# EAGLE design nh-vend v0.2 (EAGLE 9.0.1)
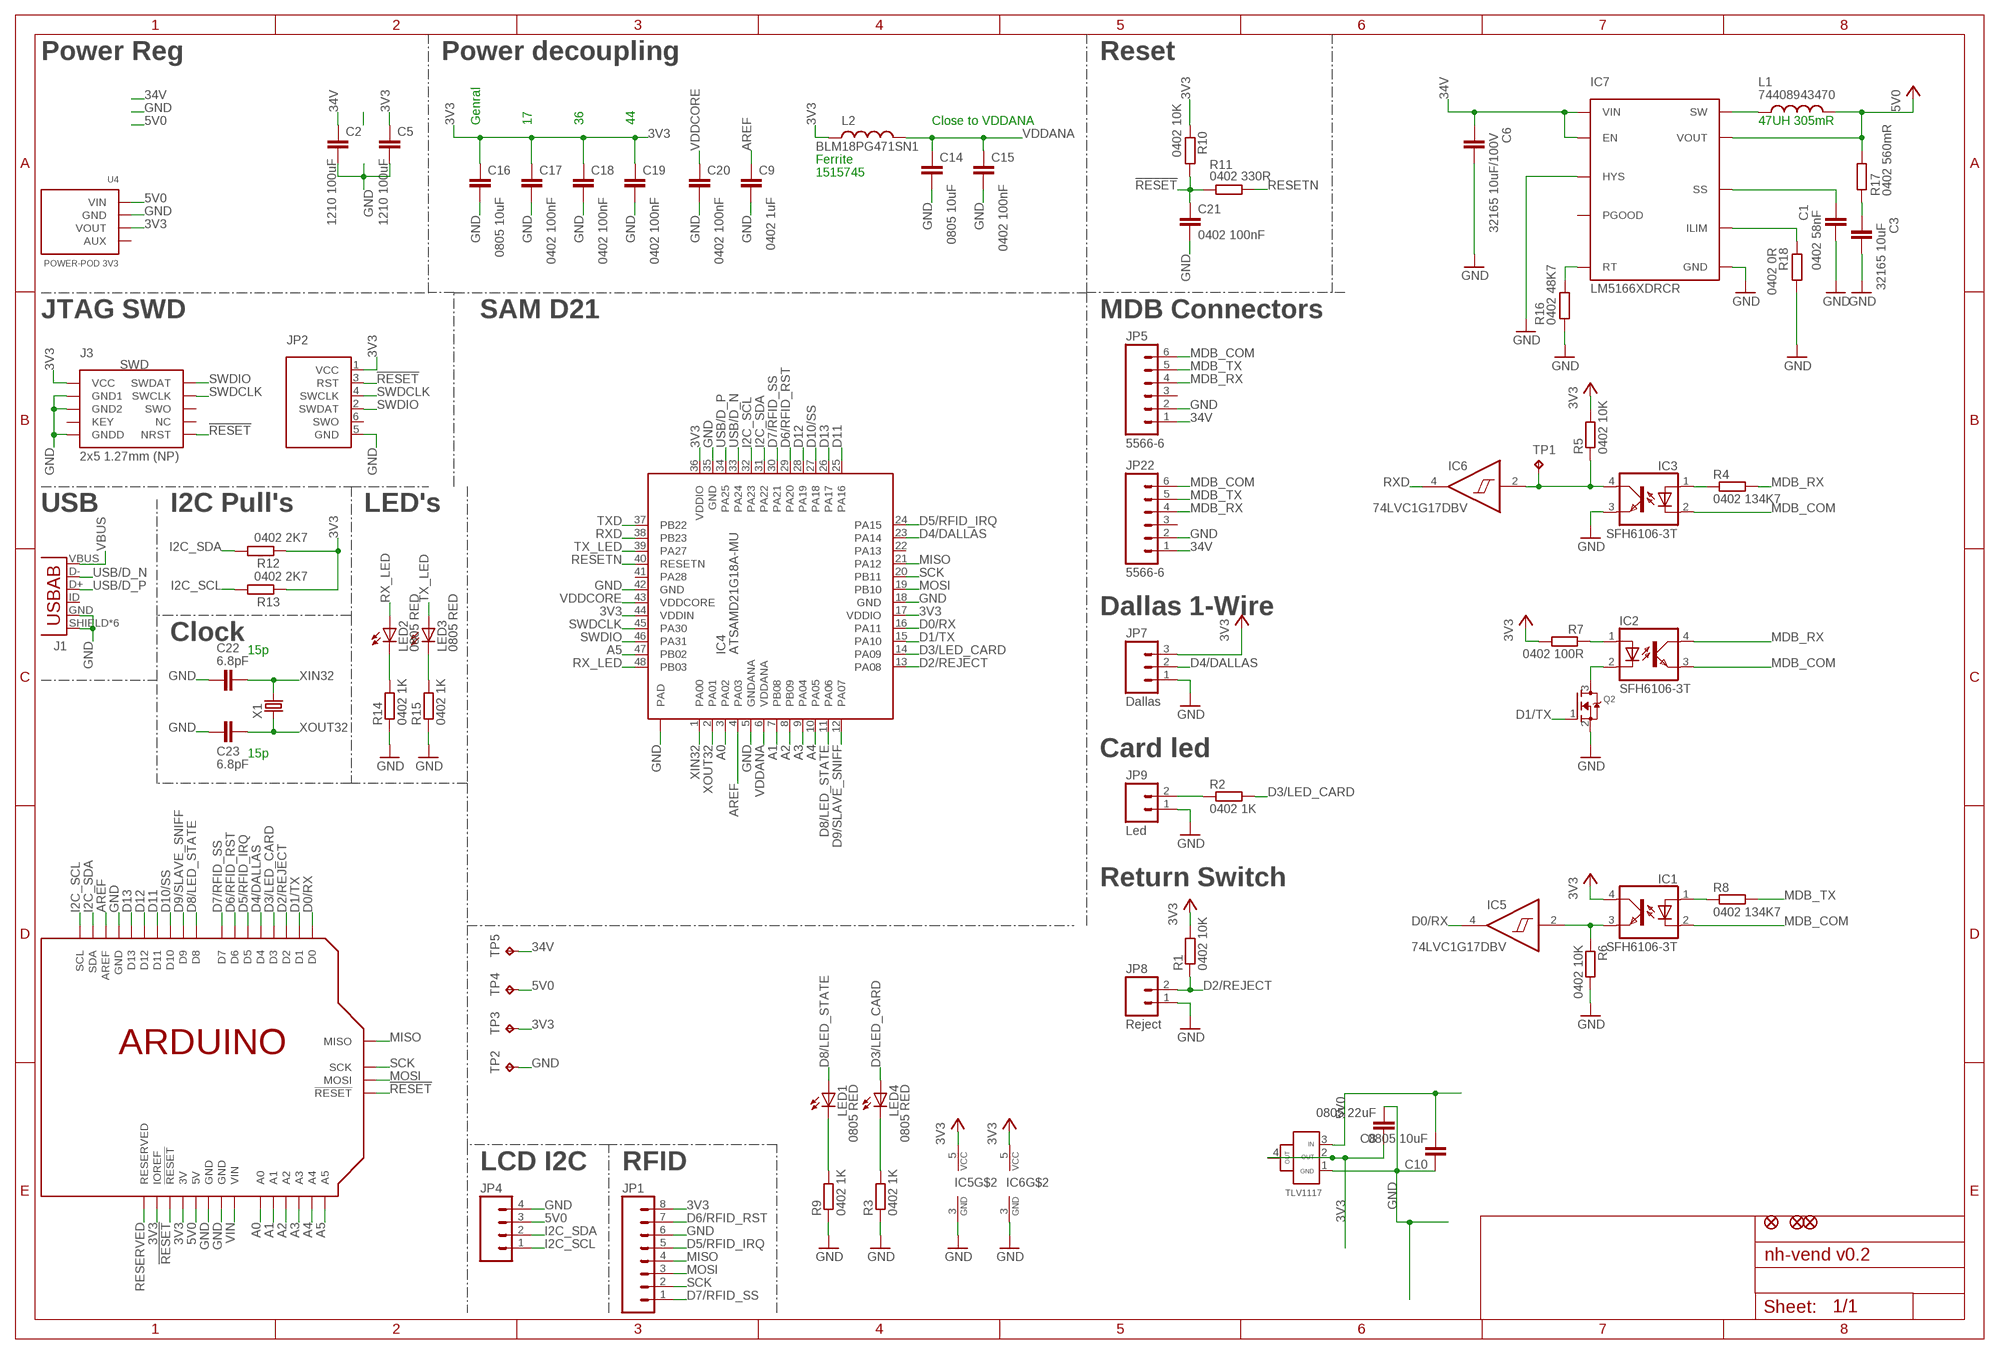
[diagram p0: schematic, sheet 1]

## Parts
C1  0402 58nF  C-EUC0402-SMALLER  [C0402-SMALLER]
C2  1210 100uF  C-EUC1210  [C1210]
C3  32165 10uF  C-EUC3216  [C3216]
C5  1210 100uF  C-EUC1210  [C1210]
C6  32165 10uF/100V  C-EUC3216  [C3216]
C8  0805 22uF  C-EUC0805  [C0805]
C9  0402 1uF  C-EUC0402-SMALLER  [C0402-SMALLER]
C10  0805 10uF  C-EUC0805  [C0805]
C14  0805 10uF  C-EUC0805K  [C0805K]
C15  0402 100nF  C-EUC0402-SMALLER  [C0402-SMALLER]
C16  0805 10uF  C-EUC0805K  [C0805K]
C17  0402 100nF  C-EUC0402-SMALLER  [C0402-SMALLER]
C18  0402 100nF  C-EUC0402-SMALLER  [C0402-SMALLER]
C19  0402 100nF  C-EUC0402-SMALLER  [C0402-SMALLER]
C20  0402 100nF  C-EUC0402-SMALLER  [C0402-SMALLER]
C21  0402 100nF  C-EUC0402-SMALLER  [C0402-SMALLER]
C22  6.8pF  C-EUC0402-SMALLER  [C0402-SMALLER]
C23  6.8pF  C-EUC0402-SMALLER  [C0402-SMALLER]
IC1  SFH6106-3T  OPTO-DC  [SO04]
IC2  SFH6106-3T  OPTO-DC  [SO04]
IC3  SFH6106-3T  OPTO-DC  [SO04]
IC4  ATSAMD21G18A-MU  ATSAMD21G-LWK  [QFN48-LWK]
IC5  74LVC1G17DBV  [SOT23-5]
IC6  74LVC1G17DBV  [SOT23-5]
IC7  LM5166XDRCR  LM5166  [VSON-10]
J1  ZX62-AB-5PA(11)  USB-AB-LWK  [USB-AB-MICRO-SMD_LWK]
J3  2x5 1.27mm (NP)  SWD_SHROUD-PINHEAD  [PINHEAD_2X05_127]
JP1  M081X08  [1X08]
JP2  (NP)  TC2030-SWDNL  [TC2030-MCP-NL]
JP3  FIDUCIAL1X2.5-STOP  [FIDUCIAL-1X2.5-STOP]
JP4  M04PTH  [1X04]
JP5  5566-6  M06-5566  [5566-6]
JP6  FIDUCIAL1X2.5-STOP  [FIDUCIAL-1X2.5-STOP]
JP7  Dallas  M03-SCREW-5MM  [SCREWTERMINAL-5MM-3]
JP8  Reject  M025MM  [SCREWTERMINAL-5MM-2]
JP9  Led  M025MM  [SCREWTERMINAL-5MM-2]
JP10  FIDUCIAL1X2.5-STOP  [FIDUCIAL-1X2.5-STOP]
JP22  5566-6  M06-5566  [5566-6]
L1  74408943470  INDUCTOR-WE-SPC  [WE-SPC_48XX]
L2  BLM18PG471SN1  INDUCTOR0603K-SMALL  [C0603K-SMALL]
LED1  0805 RED  LED0805-1206  [LED-0805-1206]
LED2  0805 RED  LED0805-1206  [LED-0805-1206]
LED3  0805 RED  LED0805-1206  [LED-0805-1206]
LED4  0805 RED  LED0805-1206  [LED-0805-1206]
Q2  MOSFET-N-SOT23-SPARK  [SOT23-3]
R1  0402 10K  R-EU_R0402-SMALLER  [R0402-SMALLER]
R2  0402 1K  R-EU_R0402-SMALLER  [R0402-SMALLER]
R3  0402 1K  R-EU_R0402-SMALLER  [R0402-SMALLER]
R4  0402 134K7  R-EU_R0402-SMALLER  [R0402-SMALLER]
R5  0402 10K  R-EU_R0402-SMALLER  [R0402-SMALLER]
R6  0402 10K  R-EU_R0402-SMALLER  [R0402-SMALLER]
R7  0402 100R  R-EU_R0402-SMALLER  [R0402-SMALLER]
R8  0402 134K7  R-EU_R0402-SMALLER  [R0402-SMALLER]
R9  0402 1K  R-EU_R0402-SMALLER  [R0402-SMALLER]
R10  0402 10K  R-EU_R0402-SMALLER  [R0402-SMALLER]
R11  0402 330R  R-EU_R0402-SMALLER  [R0402-SMALLER]
R12  0402 2K7  R-EU_R0402-SMALLER  [R0402-SMALLER]
R13  0402 2K7  R-EU_R0402-SMALLER  [R0402-SMALLER]
R14  0402 1K  R-EU_R0402-SMALLER  [R0402-SMALLER]
R15  0402 1K  R-EU_R0402-SMALLER  [R0402-SMALLER]
R16  0402 48K7  R-EU_R0402-SMALLER  [R0402-SMALLER]
R17  0402 560mR  R-EU_R0402-SMALLER  [R0402-SMALLER]
R18  0402 0R  R-EU_R0402-SMALLER  [R0402-SMALLER]
TP1  TPPAD1-10-ROUND  [P1-10-ROUND-CAN]
TP2  TPPAD1-10-ROUND  [P1-10-ROUND-CAN]
TP3  TPPAD1-10-ROUND  [P1-10-ROUND-CAN]
TP4  TPPAD1-10-ROUND  [P1-10-ROUND-CAN]
TP5  TPPAD1-10-ROUND  [P1-10-ROUND-CAN]
U1  ARDUINOSPI-REFRENCE  [ARDUINOR3-LWKTXT-REF-SPI]
U03  1117 3V0  TLV1117-33CDCY  [SOT223]
U4  POWER-POD 3V3  POWER-POD  [POWER-POD-LANDING]
X1  RESONATOR_EPSON_FC_145  [RESONATOR_EPSON_FC_145]

## Nets
3V3: C5.1 C8.1 C16.1 C17.1 C18.1 C19.1 IC1.4(COL) IC4.17(VDDIO) IC4.36(VDDIO) IC4.44(VDDIN) IC5.5(VCC) IC6.5(VCC) J3.1(VCC) JP1.8 JP2.1(VCC) JP7.3 L2.1 R1.2 R5.2 R7.2 R10.1 R12.1 R13.1 TP3.TP U1.3V U1.IOREF U03.2(OUT1) U03.4(OUT2) U4.3(VOUT)
5V0: C10.2 IC7.8(VOUT) JP4.3 L1.2 R17.1 TP4.TP U1.5V U1.5V@ISP(5V) U03.3(IN) U4.1(VIN)
34V [34V]: C2.1 C6.1 IC7.2(VIN) IC7.7(EN) JP5.1 JP22.1 TP5.TP
!RESET: C21.1 J3.10(NRST) JP2.3(RST) R10.2 R11.1 U1.!RESET U1.!RESET@ISP(!RESET)
A0: IC4.3(PA02) U1.A0
A1: IC4.7(PB08) U1.A1
A2: IC4.8(PB09) U1.A2
A3: IC4.9(PA04) U1.A3
A4: IC4.10(PA05) U1.A4
A5: IC4.47(PB02) U1.A5
AREF: C9.1 IC4.4(PA03) U1.AREF
D0/RX: IC4.16(PA11) IC5.4(O) U1.D0
D1/TX: IC4.15(PA10) Q2.1(G) U1.D1
D2/REJECT: IC4.13(PA08) JP8.2 R1.1 U1.D2
D3/LED_CARD: IC4.14(PA09) LED4.A R2.2 U1.D3
D4/DALLAS: IC4.23(PA14) JP7.2 U1.D4
D5/RFID_IRQ: IC4.24(PA15) JP1.5 U1.D5
D6/RFID_RST: IC4.29(PA20) JP1.7 U1.D6
D7/RFID_SS: IC4.30(PA21) JP1.1 U1.D7
D8/LED_STATE: IC4.11(PA06) LED1.A U1.D8
D9/SLAVE_SNIFF: IC4.12(PA07) U1.D9
D10/SS: IC4.27(PA18) U1.D10
D11: IC4.25(PA16) U1.D11
D12: IC4.28(PA19) U1.D12
D13: IC4.26(PA17) U1.D13
GND: C1.2 C2.2 C3.2 C5.2 C6.2 C8.2 C9.2 C10.1 C14.2 C15.2 C16.2 C17.2 C18.2 C19.2 C20.2 C21.2 C22.2 C23.2 IC3.3(EMIT) IC4.5(GNDANA) IC4.18(GND) IC4.35(GND) IC4.42(GND) IC4.EXP(PAD) IC5.3(GND) IC6.3(GND) IC7.9(HYS) IC7.10(GND) IC7.PAD(GND) J1.GND J1.SHIELD J1.SHIELD@0(SHIELD) J1.SHIELD@1(SHIELD) J1.SHIELD@2(SHIELD) J1.SHIELD@3(SHIELD) J1.SHIELD@5(SHIELD) J3.3(GND1) J3.5(GND2) J3.9(GNDD) JP1.6 JP2.5(GND) JP4.4 JP5.2 JP7.1 JP8.1 JP9.1 JP22.2 Q2.2(S) R3.1 R6.2 R9.1 R14.1 R15.1 R16.1 R18.1 TP2.TP U1.GND@1(GND) U1.GND@2(GND) U1.GND@3(GND) U1.GND@ISP(GND) U03.1(GND) U4.2(GND)
I2C_SCL: IC4.32(PA23) JP4.1 R13.2 U1.SCL
I2C_SDA: IC4.31(PA22) JP4.2 R12.2 U1.SDA
ILIM: IC7.3(ILIM) R18.2
LED_R: JP9.2 R2.1
MDB_COM [34V]: IC1.2(C) IC2.3(EMIT) IC3.2(C) JP5.6 JP22.6
MDB_RX [34V]: IC2.4(COL) JP5.4 JP22.4 R4.2
MDB_TX [34V]: JP5.5 JP22.5 R8.2
MISO: IC4.21(PA12) JP1.4 U1.MISO
MOSI: IC4.19(PB10) JP1.3 U1.MOSI
N$1 [34V]: IC3.1(A) R4.1
N$2: IC1.1(A) R8.1
N$3: LED4.C R3.2
N$6: IC2.1(A) R7.1
N$7: IC2.2(C) Q2.3(D)
N$8: LED1.C R9.2
N$9: LED2.C R14.2
N$10: LED3.C R15.2
N$11: IC7.5(RT) R16.2
N$12: C3.1 R17.2
RESERVED: U1.RESERVED
RESETN: IC4.40(RESETN) R11.2
RX: IC1.3(EMIT) IC5.2(I) R6.1
RX_LED: IC4.48(PB03) LED2.A
RXD: IC4.38(PB23) IC6.4(O)
SCK: IC4.20(PB11) JP1.2 U1.SCK
SLAVE_SNIFF: IC3.4(COL) IC6.2(I) R5.1 TP1.TP
SS: C1.1 IC7.4(SS)
SW: IC7.1(SW) L1.1
SWDCLK: IC4.45(PA30) J3.4(SWCLK) JP2.4(SWCLK)
SWDIO: IC4.46(PA31) J3.2(SWDAT) JP2.2(SWDAT)
TX_LED: IC4.39(PA27) LED3.A
TXD: IC4.37(PB22)
USB/D_N [90R]: IC4.33(PA24) J1.D-
USB/D_P [90R]: IC4.34(PA25) J1.D+
VBUS: J1.VBUS
VDDANA: C14.1 C15.1 IC4.6(VDDANA) L2.2
VDDCORE: C20.1 IC4.43(VDDCORE)
VIN [34V]: U1.VIN
XIN32: C22.1 IC4.1(PA00) X1.P$2
XOUT32: C23.1 IC4.2(PA01) X1.P$1
Unconnected: IC4.22(PA13) IC4.41(PA28) IC7.6(PGOOD) J1.ID(USBID) J3.6(SWO) J3.7(KEY) J3.8(NC) JP2.6(SWO) JP5.3 JP22.3 U4.4(AUX)

## Notes on the sheet
- Power Reg | Power decoupling | Reset
- Genral | 17 | 36 | 44 | Close to VDDANA | 47UH 305mR
- Ferrite
- 1515745
- JTAG SWD | SAM D21 | MDB Connectors
- USB | I2C Pull's | LED's
- Dallas 1-Wire
- Clock
- 15p
- 15p | Card led
- Return Switch
- LCD I2C | RFID

## Library data of the parts
C1-C3 C5 C6 C9 C14-C23 = CISECO eaglecad designs:C-EU: CAPACITOR, European symbol
C8 C10 = rcl:C-EU: CAPACITOR, European symbol
IC1-IC3 = SmartSentry Parts:OPTO-DC
IC4 = CISECO eaglecad designs:ATSAMD21G
IC5 IC6 = 74xx-little-us:74*1G17: Single Schmitt-Trigger Buffer
IC7 = SmartSentry Parts:LM5166
J1 = TiLDA Mk3 Parts:USB-AB: This is a USB AB connector that is compatible with USB OTG. i.e. this connector can serve as a host or device; FARNELL: 2293755
J3 = TiLDA Mk3 Parts:SWD_SHROUD; FARNELL: 1865285
JP1 = SparkFunJan12:M08: Header 8 Standard 8-pin 0.1" header. Use with straight break away headers (SKU : PRT-00116), right angle break away headers (PRT-00553), swiss pins (PRT-00743), machine pins (PRT-00117), and female headers (PRT-00115).
JP2 = TiLDA Mk3 Parts:TC2030-SWD
JP3 JP6 JP10 = CISECO eaglecad designs:FIDUCIAL: Fiducial Alignment Points Various fiducial points for machine vision alignment.
JP4 = SparkFunJan12:M04: Header 4 Standard 4-pin 0.1" header. Use with straight break away headers (SKU : PRT-00116), right angle break away headers (PRT-00553), swiss pins (PRT-00743), machine pins (PRT-00117), and female headers (PRT-00115). Molex polarized connector foot print use with SKU : PRT-08231 with associated crimp pins and housings. 1MM SMD Version SKU: PRT-10208
JP5 JP22 = CISECO eaglecad designs:M06: Header 6 Standard 6-pin 0.1" header. Use with straight break away headers (SKU : PRT-00116), right angle break away headers (PRT-00553), swiss pins (PRT-00743), machine pins (PRT-00117), and female headers (PRT-00115). Molex polarized connector foot print use with SKU : PRT-08094 with associated crimp pins and housings. NOTES ON THE VARIANTS LOCK and LOCK_LONGPADS... This footprint was designed to help hold the alignment of a through-hole component (i.e. 6-pin header) while soldering it into place. You may notice that each hole has been shifted either up or down by 0.005 of an inch from it's more standard position (which is a perfectly straight line). This slight alteration caused the pins (the squares in the middle) to touch the edges of the holes. Because they are alternating, it causes a "brace" to hold the component in place. 0.005 has proven to be the perfect amount of "off-center" position when using our standard breakaway headers. Although looks a little odd when you look at the bare footprint, once you have a header in there, the alteration is very hard to notice. Also, if you push a header all the way into place, it is covered up entirely on the bottom side. This idea of altering the position of holes to aid alignment will be further integrated into the Sparkfun Library for other footprints. It can help hold any component with 3 or more connection pins.; FARNELL: 9732101 or 1697112; MF: Molex
JP7 = CISECO eaglecad designs:M03: Header 3 Standard 3-pin 0.1" header. Use with straight break away headers (SKU : PRT-00116), right angle break away headers (PRT-00553), swiss pins (PRT-00743), machine pins (PRT-00117), and female headers (PRT-00115). Molex polarized connector foot print use with SKU : PRT-08232 with associated crimp pins and housings.
JP8 JP9 = SmartSentry Parts:M02: Header 2 Standard 2-pin 0.1" header. Use with straight break away headers (SKU : PRT-00116), right angle break away headers (PRT-00553), swiss pins (PRT-00743), machine pins (PRT-00117), and female headers (PRT-00115). Molex polarized connector foot print use with SKU : PRT-08233 with associated crimp pins and housings.
L1 = SmartSentry Parts:INDUCTOR: Inductors Basic Inductor/Choke - 0603 and 1206. Footprints are not proven and vary greatly between part numbers.
L2 = CISECO eaglecad designs:INDUCTOR: Inductors Basic Inductor/Choke - 0603 and 1206. Footprints are not proven and vary greatly between part numbers.
LED1-LED4 = CISECO eaglecad designs:LED: LEDs Standard schematic elements and footprints for 5mm, 3mm, 1206, and 0603 sized LEDs. 5mm - Spark Fun Electronics SKU : COM-00529 (and others)
Q2 = SmartSentry Parts:MOSFET-N: N-Channel Mosfet 2N7002E - 60V 260mA SOT23 [Digikey: 2N7002ET1GOSTR-ND] - REEL BSH103 - 30V 850mA SOT23 [Digikey: 568-5013-1-ND]
R1-R18 = CISECO eaglecad designs:R-EU_: RESISTOR, European symbol
TP1-TP5 = SmartSentry Parts:TP: Test pad
U1 = CISECO eaglecad designs:ARDUINOSPI
U03 = CISECO eaglecad designs:TLV1117-33CDCY
U4 = Ciseco Footprints:POWER-POD
X1 = TiLDA Mk2 Parts:RESONATOR_EPSON_FC_145

## Net classes
1 34V: clearance 0.5 mm
2 MAINS: clearance 0.5 mm to class 1, clearance 4 mm
3 90R: width 0.254 mm, clearance 0.3 mm to class 0, clearance 0.5 mm to class 1, clearance 4 mm to class 2, clearance 0.15 mm

## Board
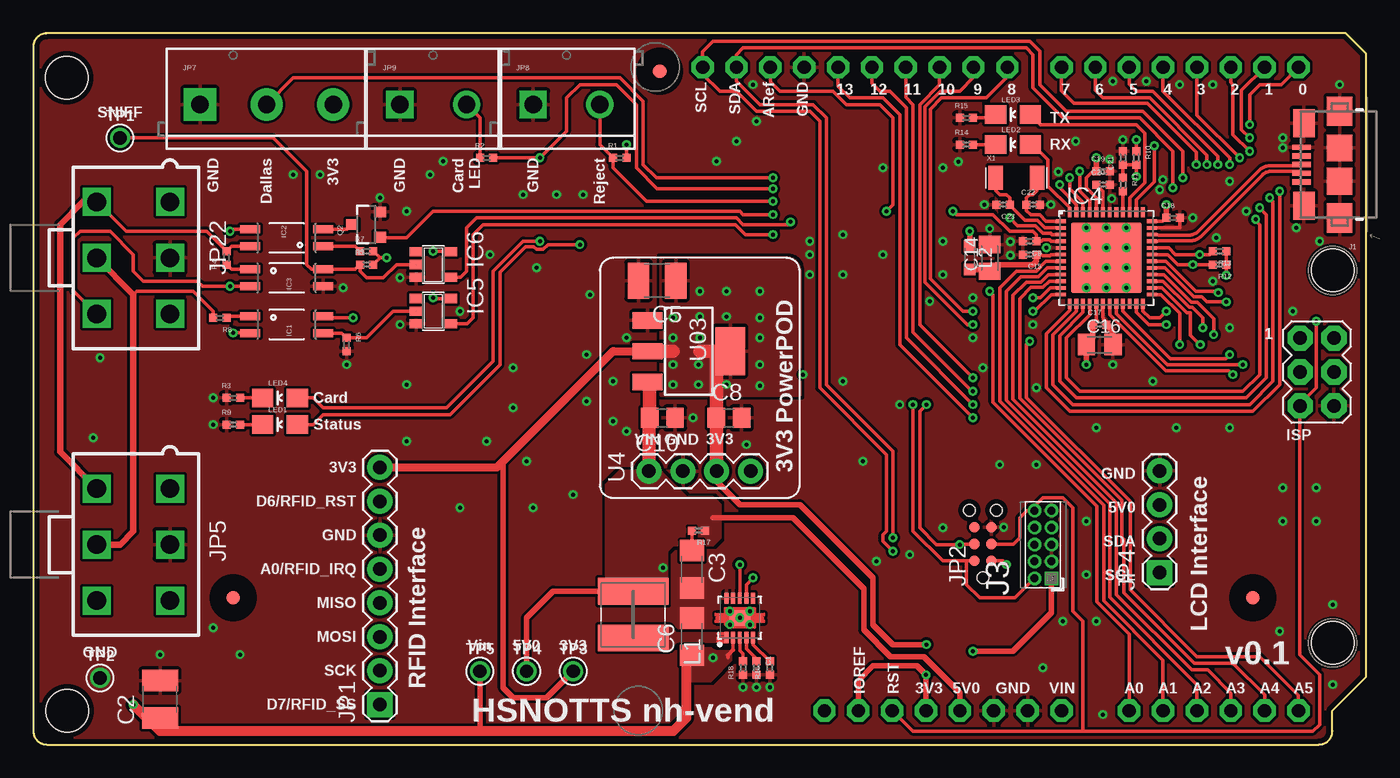
[diagram p1: board, top side]
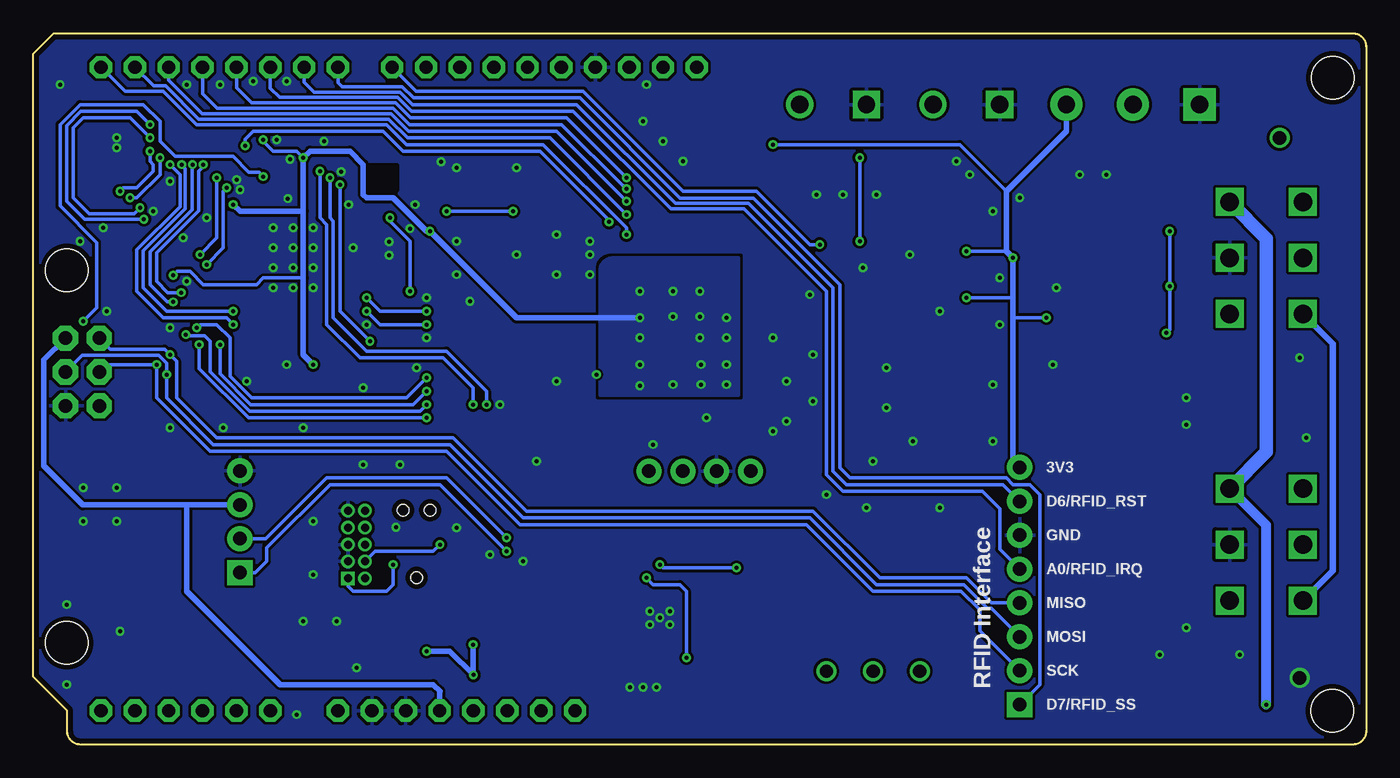
[diagram p2: board, bottom side, seen from below]

Size 100 x 53.34 mm. Coordinates in mm from the lower left corner, seen from the top.
Outline: 98.48,53.34 1,53.34 arc90 0,52.34 0,1 arc90 1,0 96.46,0 arc90 97.46,1 97.46,2.54 100,5.08 100,51.82 98.48,53.34
Copper layers (1*16): Top 0.0356mm / dielectric 1.5011mm / Bottom 0.0356mm
Design rules "default *": minimum track width 0.15mm, minimum drill 0.3mm, track to track 6mil, track to pad 6mil, pad to pad 6mil, via to via 6mil, smd to smd 6mil, copper to edge 15mil, drill to drill 12mil, minimum pad ring 7mil, minimum via ring 7mil, stop-mask expansion 3mil, vias tented up to drill 23mil, thermal gap 10mil
Holes 3.2 mm at 2.54,2.54 97.48,35.56 97.48,7.62 2.5,50

### Footprints (pad centres in the part's own frame; a part is rotated, then mirrored left to right if it is on the bottom)
C0402-SMALLER = smd 0.6 x 0.6: 1 -0.5,0; 2 0.5,0
C1210 = smd 1.6 x 2.7: 1 -1.4,0; 2 1.4,0
C3216 = smd 1.6 x 1.8: 1 -1.4,0; 2 1.4,0
C0805 = smd 1.3 x 1.5: 1 -0.95,0; 2 0.95,0
C0805K = smd 1.3 x 1.6: 1 -1,0; 2 1,0
SO04 = smd 0.6 x 1.5: 1 -0.635,-2.75; 2 0.635,-2.75; 3 0.635,2.75; 4 -0.635,2.75
QFN48-LWK = smd 0.75 x 0.28: 1 -3.425,2.75; 2 -3.425,2.25; 3 -3.425,1.75; 4 -3.425,1.25; 5 -3.425,0.75; 6 -3.425,0.25; 7 -3.425,-0.25; 8 -3.425,-0.75; 9 -3.425,-1.25; 10 -3.425,-1.75; 11 -3.425,-2.25; 12 -3.425,-2.75; 25 3.425,-2.75; 26 3.425,-2.25; 27 3.425,-1.75; 28 3.425,-1.25; 29 3.425,-0.75; 30 3.425,-0.25; 31 3.425,0.25; 32 3.425,0.75; 33 3.425,1.25; 34 3.425,1.75; 35 3.425,2.25; 36 3.425,2.75 | smd 0.28 x 0.75: 13 -2.75,-3.425; 14 -2.25,-3.425; 15 -1.75,-3.425; 16 -1.25,-3.425; 17 -0.75,-3.425; 18 -0.25,-3.425; 19 0.25,-3.425; 20 0.75,-3.425; 21 1.25,-3.425; 22 1.75,-3.425; 23 2.25,-3.425; 24 2.75,-3.425; 37 2.75,3.425; 38 2.25,3.425; 39 1.75,3.425; 40 1.25,3.425; 41 0.75,3.425; 42 0.25,3.425; 43 -0.25,3.425; 44 -0.75,3.425; 45 -1.25,3.425; 46 -1.75,3.425; 47 -2.25,3.425; 48 -2.75,3.425 | smd 5.3 x 5.3: EXP 0,0
SOT23-5 = smd 0.69 x 0.99: 1 -0.95,-1.29; 2 0,-1.29; 3 0.95,-1.29; 4 0.95,1.3; 5 -0.95,1.3
VSON-10 = smd 0.85 x 0.28: 1 -1.475,1; 2 -1.475,0.5; 3 -1.475,0; 4 -1.475,-0.5; 5 -1.475,-1; 6 1.475,-1; 7 1.475,-0.5; 8 1.475,0; 9 1.475,0.5; 10 1.475,1 | smd 1.15 x 1.5: PAD 0,0
USB-AB-MICRO-SMD_LWK = smd 1.4 x 0.4: D+ 2.85,0; D- 2.85,0.65; GND 2.85,-1.3; ID 2.85,-0.65; VBUS 2.85,1.3 | smd 1.6 x 2.1: SHIELD 2.675,3.1; SHIELD@5 2.675,-3.1 | smd 1.9 x 2: SHIELD@0 0,1.25; SHIELD@1 0,-1.25 | smd 1.9 x 2.2: SHIELD@2 0,-4; SHIELD@3 0,4
PINHEAD_2X05_127 = drill 0.6 pad 1.016 square: 1 -2.54,-0.635 | drill 0.6 pad 1.016: 2 -2.54,0.635; 3 -1.27,-0.635; 4 -1.27,0.635; 5 0,-0.635; 6 0,0.635; 7 1.27,-0.635; 8 1.27,0.635; 9 2.54,-0.635; 10 2.54,0.635
1X08 = drill 1.016 pad 1.88 square: 1 0,0 | drill 1.016 pad 1.88: 2 2.54,0; 3 5.08,0; 4 7.62,0; 5 10.16,0; 6 12.7,0; 7 15.24,0; 8 17.78,0
TC2030-MCP-NL = smd 0.787 x 0.787: 1 1.27,-0.635; 2 1.27,0.635; 3 2.54,-0.635; 4 2.54,0.635; 5 3.81,-0.635; 6 3.81,0.635 | hole 0.889: 0,0; 5.08,-1.016; 5.08,1.016
FIDUCIAL-1X2.5-STOP = smd 1 x 1: 1 0,0
1X04 = drill 1.016 pad 1.88 square: 1 0,0 | drill 1.016 pad 1.88: 2 2.54,0; 3 5.08,0; 4 7.62,0
5566-6 = drill 1.4 square: 1 4.2,-2.75; 2 0,-2.75; 3 -4.2,-2.75; 4 4.2,2.75; 5 0,2.75; 6 -4.2,2.75
SCREWTERMINAL-5MM-3 = drill 1.3 pad 2.413 square: 1 0,0 | drill 1.3 pad 2.413: 2 5,0; 3 10,0
SCREWTERMINAL-5MM-2 = drill 1.3 pad 2.032 square: 1 0,0 | drill 1.3 pad 2.032: 2 5,0
WE-SPC_48XX = smd 2 x 5.3: 1 -1.75,0; 2 1.75,0
C0603K-SMALL = smd 0.889 x 0.889: 1 -0.875,0; 2 0.875,0
LED-0805-1206 = smd 1.6 x 1.4: A 1.3,0; C -1.3,0
SOT23-3 = smd 0.9 x 0.8: 1 1,-0.95; 2 1,0.95; 3 -1.1,0
R0402-SMALLER = smd 0.6 x 0.6: 1 -0.5,0; 2 0.5,0
P1-10-ROUND-CAN = drill 1: TP 0,0
ARDUINOR3-LWKTXT-REF-SPI = drill 1 pad 1.676 octagon: 3V 35.56,2.54; 5V 38.1,2.54; !RESET 33.02,2.54; A0 50.8,2.54; A1 53.34,2.54; A2 55.88,2.54; A3 58.42,2.54; A4 60.96,2.54; A5 63.5,2.54; AREF 23.876,50.8; D0 63.5,50.8; D1 60.96,50.8; D2 58.42,50.8; D3 55.88,50.8; D4 53.34,50.8; D5 50.8,50.8; D6 48.26,50.8; D7 45.72,50.8; D8 41.656,50.8; D9 39.116,50.8; D10 36.576,50.8; D11 34.036,50.8; D12 31.496,50.8; D13 28.956,50.8; GND@1 43.18,2.54; GND@2 40.64,2.54; GND@3 26.416,50.8; IOREF 30.48,2.54; RESERVED 27.94,2.54; SCL 18.796,50.8; SDA 21.336,50.8; VIN 45.72,2.54 | drill 1.016 pad 1.88 octagon: 5V@ISP 66.167,30.48; !RESET@ISP 63.627,25.4; GND@ISP 66.167,25.4; MISO 63.627,30.48; MOSI 66.167,27.94; SCK 63.627,27.94
SOT223 = smd 1.219 x 2.235: 1 -2.311,-3.099; 2 0,-3.099; 3 2.311,-3.099 | smd 3.6 x 2.2: 4 0,3.099
POWER-POD-LANDING = drill 1.016 pad 1.88: 1 -3.81,0; 2 -1.27,0; 3 1.27,0; 4 3.81,0
RESONATOR_EPSON_FC_145 = smd 1.1 x 1.8: P$1 -1.55,0; P$2 1.55,0

### Placement (x,y rotation side)
C1  54.25,5.75 270 top
C2  9.5,3.4 90 top
C3  49.4,13.15 270 top
C5  46.8,34.8 180 top
C6  49.4,8.1 90 top
C8  52.19,24.5 0 top
C9  74.75,37.75 180 top
C10  47.19,24.5 180 top
C14  71.75,36.5 90 top
C15  74.75,36.75 180 top
C16  80,30 0 top
C17  80,31.5 0 top
C18  85.5,39.5 0 top
C19  80.25,43 0 top
C20  80.25,42 0 top
C21  81.75,44 90 top
C22  75,40.5 0 top
C23  72.75,40.5 180 top
IC1  19,31.5 270 top
IC2  19,38 90 top
IC3  19,35 270 top
IC4  80.5,36.5 0 top
IC5  30,32.5 270 top
IC6  30,36 270 top
IC7  53,9.5 90 top
J1  98,43.5 180 top
J3  75.75,15 90 top
JP1  26,3 90 top
JP2  71.25,12.5 90 top
JP3  91.5,11 0 top
JP4  84.5,12.9 90 top
JP5  7.5,15 90 top
JP6  47,50.5 0 top
JP7  12.5,48 0 top
JP8  37.5,48 0 top
JP9  27.5,48 0 top
JP10  15,11 0 top
JP22  7.5,36.5 90 top
L1  45,9.75 90 top
L2  70.25,36.5 270 top
LED1  18.5,24 0 top
LED2  73.5,45 0 top
LED3  73.5,47.25 0 top
LED4  18.5,26 0 top
Q2  25,39 0 top
R1  44,44 0 top
R2  34,44 0 top
R3  15,26 0 top
R4  14.5,36.5 90 top
R5  25,36 0 top
R6  23.5,30 270 top
R7  25,37 0 top
R8  14,32 180 top
R9  15,24 0 top
R10  82.75,44 270 top
R11  81.75,42 270 top
R12  89,36 180 top
R13  89,37 180 top
R14  70,45 0 top
R15  70,47 0 top
R16  55.25,5.75 90 top
R17  49.9,16.05 180 top
R18  53.25,5.75 90 top
TP1  6.5,45.5 0 top
TP2  5,5 0 top
TP3  40.5,5.5 0 top
TP4  37,5.5 0 top
TP5  33.5,5.5 0 top
U1  31.42,0 0 top
U03  49.19,29.5 270 top
U4  50,20.5 0 top
X1  73.75,42.5 0 top

### Tracks (layer width: path | path; a pad name or v marks a point on that pad's centre or on a via)
3V3  (via drill 0.3)
  Top 0.254: R7.2 26,36.5 | 26,36.5 v26.5,36.5 | R5.2 26,36.5 | IC1.4 21.89,32 v24,32 | R1.2 v44.5,45 | IC4.44 79.75,41 79,41.75 79,42.5 79.5,43 C19.1 | R10.1 v82.75,45.35 | IC4.17 79.75,31.75 | IC4.36 84.75,39.25 C18.1 | IC6.5 31.25,37 v30,37 | 89.5,36.75 R13.1 R12.1 | 89.5,35.75 R12.1 | JP2.1 72.73,13.77 v73,13.5 | R12.1 v89.5,35.2 | IC5.5 30.05,33.45 v30,33.5
  Top 0.4: C19.1 v79.75,44 | L2.1 v70.25,38.5 | 79.75,31.75 C17.1 79.5,30.5 C16.1 v79,28.5 | C18.1 v85,40.5 | J3.1 76.39,9.88 73.5,7 v70.5,7 | U1.IOREF 61.9,4.8 63,5.9
  Top 0.406: U1.3V v66.98,5.22 66.3,5.9 63,5.9 | U4.3 51.27,19.73 53,18 57.5,18 63,12.5 63,9 64.5,7.5 v67,7.5 | TP3.TP 38.5,3.5 36,3.5 35.25,4.25 35.25,21.25 36.25,22.25
  Top 0.61: JP1.8 34.78,20.78 36.25,22.25 43.5,29.5 U03.2
  Top 1.016: U03.2 48,29.5 | 50,29.5 U03.4 51.24,29.5 C8.1 51.27,24.5 U4.3
  Bottom 0.254: v24,32 26.5,32 | v44.5,45 30.5,45 27,41.5 | v30,37 27,37 | v73,13.5 73,12 73.5,11.5 76,11.5 76.39,11.88 J3.1 | v79.75,44 80.26,44.51 81,44.51 81.01,44.5 82,44.5 82.75,45.25 v82.75,45.35 | v89.5,35.2 89.2,35.5 88.25,35.5 87.25,34.5 83.25,34.5 82.75,35 79.75,35 | v30,33.5 26.5,33.5
  Bottom 0.4: JP1.8 26.5,21.28 26.5,32 26.5,33.5 v26.5,36.5 27,37 27,41.5 22.5,46 JP7.3 | v79,28.5 79.75,29.25 79.75,35 79.75,40 | 79.75,40 v79.75,44 79.25,44.5 76.25,44.5 75.25,43.5 75.25,41.25 75,41 73,41 70.5,38.5 v70.25,38.5 63.9,32.15 | v70.5,7 68.76,7 v66.98,5.22 | v85,40.5 84.5,40 79.75,40
  Bottom 0.406: v67,7.5 67,5.24 v66.98,5.22 | 63.9,32.15 63.75,32 v54.5,32
  other vias: 48,32 50,32.1 49.9,27 48,27 52,27 54.5,26.9 54.5,28.5 52,32.1 52,34 54.5,34 50,34 49.9,28.5 48,28.5 48,30.5 50,30.5 54.5,30.5
  pour Top: 57.5,26.2 57.5,35.5 arc90 56.5,36.5 47.1,36.5 47.1,26.2
  pour Bottom: 57.5,26.2 57.5,35.5 arc90 56.5,36.5 47.1,36.5 47.1,26.2
5V0  (via drill 0.3)
  Top 0.254: IC7.8 v53,13.5
  Top 0.406: U1.5V 69.52,3.88 66.8,6.6 64.3,6.6 62.3,8.6 62.3,11.7 57,17 51,17 | TP4.TP 37,9.5 39,11.5 44,11.5
  Top 1.016: U03.3 46.24,27.19 C10.2 46.19,24.5 U4.1
  Bottom 0.254: v53,13.5 52.75,13.25 v47.25,13.25
  Bottom 0.4: 88.5,17.98 88.5,11.5 81.5,4.5 70,4.5 69.5,4 69.52,3.98 U1.5V
  Bottom 0.406: U4.1 | JP4.3 88.5,17.98 96.28,17.98 99.2,20.9 99.2,28.87 U1.5V@ISP
  pour Top (no thermals): 47,11 43,11 43,19.5 44,20.5 47,20.5 49,18.5 51,18.5 51.5,18 51.5,15.5 51,15 48,15 47.5,14.5 47.5,11
34V  (via drill 0.3)
  Top 0.254: IC7.2 52.5,7.1 | 52.1,6.7 52.1,6.5 | IC7.7 53.5,12 v54,12.5
  Top 0.3: 52.5,7.1 52.1,6.7
  Top 0.4: C2.1 9.5,1 | TP5.TP 33.5,1
  Top 0.75: v7.5,3 9.5,1 33.5,1 48,1 49,2 49,6
  Bottom 0.254: v54,12.5 53.5,12 51.5,12 51,11.5 v51,6.5
  Bottom 0.75: v7.5,3 7.5,16.45 JP5.1
  Bottom 1: JP22.1 7.5,37.95 7.5,21.95 JP5.1
  pour Top (no thermals): 52.5,7.2 52.5,6.5 50.8,4.8 48.8,4.8 48.8,7.2
!RESET  (via drill 0.3)
  Top 0.254: R11.1 C21.1 R10.2 v82.75,42.6 | U1.!RESET 65.98,1 78.75,1 | 78.75,1 96,1 96.5,1.5 96.5,5.25 95,6.75 95,25.35 U1.!RESET@ISP 95.05,25.55 96.27,26.77 96.27,30.98 96.25,31 v96.25,31.75 | JP2.3 73.54,15.04 74,15.5 74,17 74.54,17.54 J3.10 75.11,17.86 75.75,18.5 77.25,18.5 78,17.75 78,10 78.75,9.25 78.75,1
  Bottom 0.254: v96.25,31.75 95.25,32.75 95.25,37.64 98,40.39 98,46.5 96.5,48 91.75,48 90.5,46.75 90.5,45.25 89.36,44.11 85.01,44.11 83.83,42.92 83.08,42.92 v82.75,42.6
A0  (via drill 0.3)
  Top 0.254: U1.A0 82.22,8.28 79.8,10.7 79.8,17.88 72,25.68 72,33.75 v71.75,34 | IC4.3 76.43,38.25 76.35,38.33 75.75,38.33 75.17,38.91 73.84,38.91 v73.25,39.5
  Bottom 0.254: v71.75,34 71.75,37.75 73.25,39.25 v73.25,39.5
A1
  Top 0.254: U1.A1 84.76,6.34 80.3,10.8 80.3,17.95 72.5,25.75 72.5,34.25 73.75,35.5 75.25,35.5 75.99,36.24 76.42,36.24 76.43,36.25 IC4.7
A2
  Top 0.254: U1.A2 87.3,4.5 80.75,11.05 80.75,18.07 73,25.82 73,34 74.09,35.09 75.42,35.09 76.08,35.75 IC4.8
A3
  Top 0.254: U1.A3 89.84,3.86 88.1,5.6 86.9,5.6 81.25,11.25 81.25,18.15 73.5,25.9 73.5,33.69 74.5,34.69 75.59,34.69 76.15,35.25 IC4.9
A4
  Top 0.254: IC4.10 76.22,34.75 75.75,34.28 74.83,34.28 74,33.45 74,25.97 81.66,18.32 81.66,15.14 81.8,15 | 81.8,15.4 81.8,15 | 81.8,15 81.8,11.4 87.1,6.1 90,6.1 92.38,3.72 U1.A4
A5  (via drill 0.3)
  Top 0.254: IC4.47 78.25,40.5 77,41.75 v77,42 | U1.A5 94.92,3.68 92,6.6 87.3,6.6 82.3,11.6 82.3,18.25 74.52,26.02 74.52,30.02 v74.75,30.25
  Bottom 0.254: v77,42 77,32.5 v74.75,30.25
AREF  (via drill 0.3)
  Top 0.254: IC4.4 76.36,37.75 76.25,37.86 75.75,37.86 75.64,37.75 C9.1 75.25,38.25 75,38.5 73.25,38.5 72,39.75 69.25,39.75 v69,40 | U1.AREF 55.3,49.7 56,49 60,49 61,48 63.5,48 64.5,47 64.5,40.5 v64,40
  Bottom 0.254: v69,40 v64,40
D0/RX  (via drill 0.3)
  Top 0.254: IC4.16 79.25,32.25 77.5,30.5 77.5,27.5 78.5,26.5 90.75,26.5 92,27.75 92,39 91.7,39.3 v91.7,39.4 | U1.D0 93.62,49.5 92,49.5 91.25,48.75 v91.25,46.5 | IC5.4 32.55,31.55 33,32 33,38.25 33.75,39 52.67,39 53.42,38.25 v55.5,38.25
  Bottom 0.254: U1.D0 93.12,49 90.25,49 87.75,46.5 73.5,46.5 72,45 61.75,45 55.5,38.75 v55.5,38.25 | v91.25,46.5 92.25,47.5 96.42,47.5 97.5,46.42 97.5,40.75 96.15,39.4 v91.7,39.4
D1/TX  (via drill 0.3)
  Top 0.254: Q2.1 26.05,38 28,38 30,40 53,40 53.25,39.75 v55.5,39.75 | IC4.15 78.75,32.42 77,30.68 77,27.25 78.25,26 91,26 92.5,27.5 92.5,39.75 v92,40.25 | U1.D1 90.64,49.06 90.64,46.11 v91.25,45.5
  Bottom 0.254: U1.D1 90.99,49.41 90.08,49.41 87.58,46.91 73.33,46.91 71.92,45.5 61.25,45.5 v55.5,39.75 | v91.25,45.5 92.75,47 96.25,47 97,46.25 97,41 95.81,39.81 92.44,39.81 v92,40.25
D2/REJECT  (via drill 0.3)
  Top 0.254: U1.D2 89.84,49.66 90,49.5 90,45.75 v91.25,44.5 | JP8.2 42.5,45 R1.1 | R1.1 43.5,43.5 | IC4.13 77.75,32.58 76,30.82 76,26.75 77.75,25 91.5,25 93.5,27 v93.5,41.5 | v55.5,40.75 46,40.75 43.5,43.25 R1.1
  Bottom 0.254: v91.25,44.5 91.25,43.75 91,43.5 91,43 92.25,41.75 93.25,41.75 v93.5,41.5 | U1.D2 89.84,49.84 87.31,47.31 73.16,47.31 71.85,46 60.75,46 v55.5,40.75
D3/LED_CARD  (via drill 0.3)
  Top 0.254: IC4.14 78.25,32.5 76.5,30.75 76.5,27 78,25.5 91.25,25.5 93,27.25 93,40.75 v92.75,41 | U1.D3 87.3,47.2 v90.5,44 | R2.2 v38,44 40,46 40,48.5 41,49.5 43.75,49.5 45.25,48 45.25,43.25 46.81,41.69 v55.5,41.69 | LED4.A 21,26 21.75,25.25 31,25.25 34.5,28.75 34.5,35.5 36.75,37.75 v38,37.75
  Bottom 0.254: U1.D3 87.3,48.8 86.22,47.72 73,47.72 71.78,46.5 60.36,46.5 55.75,41.89 55.7,41.89 v55.5,41.69 | v38,37.75 v38,44 | v92.75,41 92.25,41 90.5,42.75 v90.5,44
D4/DALLAS  (via drill 0.3)
  Top 0.254: JP7.2 19.5,50 44,50 45.75,48.25 45.75,43.5 46.75,42.5 v55.5,42.5 | IC4.23 82.75,32.42 83.67,31.5 v85,31.5 | U1.D4 84.76,48.99 89.75,44 v89.75,43.5
  Bottom 0.254: v85,31.5 85.5,32 90.25,32 92.25,34 92.25,37.1 89,40.35 89,42.75 v89.75,43.5 | U1.D4 84.76,49.26 83.63,48.13 72.83,48.13 71.7,47 60,47 v55.5,42.5
D5/RFID_IRQ  (via drill 0.3)
  Top 0.254: IC4.24 83.25,32.5 83.75,32 84.5,32 v85,32.5 | U1.D5 82.22,49.53 82.75,49 84,49 88.87,44.13 v88.87,43.5
  Bottom 0.254: v85,32.5 90,32.5 91.75,34.25 91.75,37.02 88.59,40.18 88.59,43.18 88.67,43.25 88.67,43.3 v88.87,43.5 | JP1.5 27.5,14.66 27.5,17.7 28.8,19 39.25,19 40.5,20.25 40.5,34 46.67,40.17 52.17,40.17 59.5,47.5 71.63,47.5 72.66,48.53 81.53,48.53 82.22,49.22 U1.D5
D6/RFID_RST  (via drill 0.3)
  Top 0.254: U1.D6 79.68,49.07 80.25,48.5 83.75,48.5 88.06,44.19 v88.06,43.5 | v89.5,33.19 88.06,33.19 87.66,33.59 87.06,33.59 84.91,35.75 IC4.29
  Bottom 0.254: JP1.7 27.26,19.5 39,19.5 40,20.5 40,34.25 46.33,40.58 51.83,40.58 59.25,48 71.55,48 72.49,48.94 78.94,48.94 79.68,49.68 U1.D6 | v89.5,33.19 89.94,33.19 91.25,34.5 91.25,36.95 88.09,40.11 88.09,43.46 v88.06,43.5
D7/RFID_SS  (via drill 0.3)
  Top 0.254: U1.D7 77.14,49.03 78.08,48.09 83.58,48.09 87.25,44.42 v87.25,43.5 | IC4.30 84.98,36.25 87.23,34 88.8,34 v88.9,33.9
  Bottom 0.254: U1.D7 77.14,49.64 76.84,49.34 72.32,49.34 71.48,48.5 59,48.5 51.49,40.99 45.99,40.99 39.5,34.5 39.5,20.75 38.75,20 27,20 26.5,19.5 25.25,19.5 24.5,18.75 24.5,4.5 JP1.1 | v87.25,43.5 87.25,43.35 87.6,43 87.6,40.03 90.75,36.88 90.75,34.75 89.9,33.9 v88.9,33.9
D8/LED_STATE  (via drill 0.3)
  Top 0.254: IC4.11 76.3,34.25 75.55,33.5 v75,33.5 | U1.D8 73.08,50.08 71.5,48.5 68.15,48.5 67.31,47.66 67.31,34.94 69.75,32.5 v70.5,32.5 | LED1.A 21,24 21.75,24.75 31.25,24.75 35,28.5 35,35.42 36.92,37.34 37.55,37.34 37.75,37.14 38.25,37.14 38.61,37.5 v41,37.5
  Bottom 0.254: v75,33.5 74,32.5 v70.5,32.5 | U1.D8 71.28,49 58.75,49 51.25,41.5 45.75,41.5 41.75,37.5 v41,37.5
D9/SLAVE_SNIFF  (via drill 0.3)
  Top 0.254: IC4.12 76.37,33.75 75.12,32.5 v75,32.5 | U1.D9 70.54,50.04 69.5,49 68.08,49 66.91,47.83 66.91,34.67 70.08,31.5 v70.5,31.5
  Bottom 0.254: v75,32.5 74,31.5 v70.5,31.5
D10/SS  (via drill 0.3)
  Top 0.254: v87.75,31.25 87.75,32 86.97,32.78 86.73,32.78 84.76,34.75 IC4.27 | U1.D10 68,49.5 66.5,48 66.5,31.5 v70.5,27.5
  Bottom 0.254: v87.75,31.25 87.5,31.5 86.25,31.5 85.25,30.5 85.25,27.62 83.63,26 72,26 v70.5,27.5
D11  (via drill 0.3)
  Top 0.254: U1.D11 65.46,48.54 66,48 66,30.93 70.42,26.5 v70.5,26.5 | IC4.25 84.61,33.75 86,32.36 v86,30
  Bottom 0.254: v70.5,26.5 71.5,25.5 83.71,25.5 86,27.79 v86,30
D12  (via drill 0.3)
  Top 0.254: v88.56,30.75 88.56,31.94 87.31,33.19 86.9,33.19 84.83,35.25 IC4.28 | U1.D12 62.92,49.58 63.5,49 64.25,49 65.5,47.75 65.5,30.5 v70.5,25.5
  Bottom 0.254: v88.56,30.75 88.36,30.75 88.25,30.64 87.14,30.64 86.75,30.25 86.75,27.97 83.78,25 71,25 v70.5,25.5
D13  (via drill 0.3)
  Top 0.254: v87.56,30 87.5,30 86.81,30.69 86.81,32.37 86.8,32.37 86.56,32.37 84.68,34.25 IC4.26 | U1.D13 60.38,49.37 61.25,48.5 63.75,48.5 65,47.25 65,30 v70.5,24.5
  Bottom 0.254: v87.56,30 87.56,28.2 83.86,24.5 v70.5,24.5
GND  (via drill 0.3)
  Top 0.254: IC4.18 80.25,32.1 arc45 C17.2 | IC4.35 86,38.75 C18.2 86,38.76
  Top 0.3: 51.3,9.5 54.7,9.5
  Top 0.4: C17.2 80.71,31.29 arc-45 81,30.59 C16.2
  other vias: 80.5,37.25 79,37.25 79,38.75 80.5,38.75 82,38.75 82,37.25 82,35.75 80.5,35.75 79,35.75 87,39.5 81,28.5 73.3,37.7 73.3,36.7 71.75,38.7 76.35,40.5 71.35,40.5 80.9,40.95 80.75,43.9 81.75,45.35 27.5,35 27.5,31.5 97.5,10.5 93.5,8.5 97.5,4.5 89.75,31.25 84,27.25 94.5,32.5 94.75,38.75 93.75,44.75 88.5,49.5 86,49.5 83.5,49.75 81,49.75 76,37.25 84.5,41.6 72.8,16.3 88.75,38 98,49.5 75.25,26.75 79.75,23.75 79.75,9.25 80.25,2.25 79,34.25 80.5,34.25 82,34.25 54,49.5 71.25,28.25 70.5,30.5 70.5,33.5 65,25.5 76.9,42.95 78.2,45.25 69.4,43.7 67.25,33.25 68.25,35.25 63.75,36.75 68.25,37.75 26,41 28,40 23.5,28.5 19.5,42.75 21.5,42.75 43.5,27.25 41.5,25.75 43.5,24.25 36,25.25 41.5,29.25 36,28.25 58.25,37.75 58.25,36.75 51.25,43.75 52.75,45.25 54.25,46.75 63.75,43.25 68.25,43.25 41.25,41.25 39.25,41.25 36.75,41.25 37.75,35.75 34.25,36.75 32,32.5 28,27 28,22.75 37,21.25 34,22.75 40.5,18.75 32,17.75 37.5,17.75 9.5,6.75 13.5,8.75 15.5,6.75 13.5,26 13.5,24 4.5,23 5,29 75,31.5 85.75,23.75 89.75,23.75 93.75,16.75 93.75,19.25 96.25,19.25 96.25,16.75 77.25,9.25 75.75,5.75 60.75,38.25 60.75,35.25 58.25,35.25 60.75,27.25 57.75,27.75 62.25,21.25 68.25,16.25 65.75,14.25 63.25,13.75 75.25,21 72.5,21 79,16.75 79,12.75 93.75,45.5 89.75,42.25 91,40 88.5,34.75 84.75,42.35 23.25,34.25 29.75,42.75 30.75,43.75 96.5,37.75 41.75,33.75 55.25,4.3 54.25,4.3 53.25,4.3 53,9.5 52.25,9 52.25,10 53.75,9 53.75,10 44.5,23.5 49.5,24.5 53.5,22.5 44.5,30.5
  pour Bottom (isolate 0.203, rank 6): 0,1 arc90 1,0 96.46,0 arc90 97.46,1 97.46,2.54 100,5.1 100,51.82 98.48,53.34 1,53.34 arc90 0,52.34
  pour Top (isolate 0.203, rank 6): 98.48,53.34 1,53.34 arc90 0,52.34 0,1 arc90 1,0 96.46,0 arc90 97.46,1 97.46,2.54 100,5.1 100,51.82
  pour Top (no thermals): 55.4,9.2 51.1,9.2 51.1,8.7 48.4,8.7 47.9,9.2 47.9,12.9 51.1,12.9 51.1,9.9 51.2,9.8 55.4,9.8
I2C_SCL  (via drill 0.3)
  Top 0.254: v86.25,42.5 86.25,44.5 83.25,47.5 77.5,47.5 75.5,49.5 75.5,52 74.75,52.75 51,52.75 50.22,51.97 U1.SCL 50.22,50.28 51.5,49 52.75,49 54.25,47.5 58.25,47.5 59,46.75 59,26.75 64,21.75 64,16 63.75,15.75 63.75,15.25 v64.5,14.5 | R13.2 88.25,36.75 v87.5,36.75 85.67,36.75 85.18,37.24 | 85.18,37.24 84.65,37.24 | IC4.32 85.17,37.25 85.18,37.24
  Bottom 0.254: JP4.1 83.35,12.9 82.5,13.75 82.5,14.75 77.75,19.5 69.5,19.5 v64.5,14.5 | v86.25,42.5 86.25,38 v87.5,36.75
I2C_SDA  (via drill 0.3)
  Top 0.254: IC4.31 85.1,36.75 85.85,36 v87,36 R12.2 | v85.5,41.75 85.5,44.5 83,47 77.25,47 75,49.25 75,51.75 74.5,52.25 53.25,52.25 52.75,51.75 U1.SDA | U1.SDA | v64.5,15.5 64.5,22 59.5,27 59.5,43 59.5,47 58.5,48 56,48 54.5,48 52.75,49.75 U1.SDA
  Bottom 0.254: v87,36 85.75,37.25 85.75,41.5 v85.5,41.75 | JP4.2 82.56,15.44 78,20 69,20 v64.5,15.5
ILIM
  Top 0.254: IC7.3 53,7.05 53.25,6.8 R18.2
LED_R
  Top 0.254: JP9.2 33.5,47 R2.1
MDB_COM  (via drill 0.3)
  Top 0.254: JP22.6 3,34.05 3,38 3.5,38.5 5.75,38.5 7.5,36.75 7.5,35.5 8.25,34.75 12.31,34.75 12.7,34.37 v14.75,34.37 IC3.2 | v15,30.87 16.24,30.87 IC1.2 | IC2.3 14.88,38.63 v14.75,38.5
  Bottom 0.254: v15,30.87 14.75,31.12 v14.75,34.37 v14.75,38.5
  Bottom 0.5: JP22.6 2.5,30.05 2.5,13.05 JP5.6
MDB_RX
  Top 0.254: IC2.4 14.87,37.37 R4.2 13,38.5 6.95,38.5 JP22.4
  Top 0.5: JP22.4 3.7,40.7 2,39 2,21.95 JP5.4
MDB_TX
  Top 0.254: R8.2 13.5,32.5 12,34 7.75,34 7.5,33.75
  Top 0.5: JP5.5 6.5,15 7.5,16 7.5,33.75 JP22.5
MISO  (via drill 0.3)
  Top 0.254: IC4.21 81.75,32.5 85.3,28.95 89.45,28.95 v89.75,29.25
  Bottom 0.254: JP1.4 28.12,10.62 30,12.5 36.5,12.5 41.5,17.5 63,17.5 68.5,23 86.25,23 89.25,26 89.25,28.75 v89.75,29.25 90.15,29.65 94.22,29.65 U1.MISO
MOSI  (via drill 0.3)
  Top 0.254: IC4.19 80.75,32.25 84.95,28.05 89.7,28.05 v90,27.75
  Bottom 0.254: JP1.3 28.13,10.21 28.41,10.21 30.2,12 36.75,12 41.75,17 63.25,17 68.75,22.5 86.5,22.5 90,26 v90,27.75 90,28.61 90.59,29.2 96.33,29.2 U1.MOSI
N$1
  Top 0.254: IC3.1 14.87,35.63 R4.1
N$2
  Top 0.254: IC1.1 14.63,32.13 R8.1
N$3
  Top 0.254: LED4.C R3.2
N$6
  Top 0.254: R7.1 24.14,37.37 IC2.1
N$7
  Top 0.254: IC2.2 23.54,38.63 Q2.3
N$8
  Top 0.254: R9.2 LED1.C
N$9
  Top 0.254: LED2.C R14.2
N$10
  Top 0.254: R15.2 71.95,47 LED3.C
N$11
  Top 0.254: R16.2 54,7.5 IC7.5
N$12
  Top 0.254: C3.1 R17.2
RESETN
  Top 0.254: IC4.40 R11.2
RX
  Top 0.254: IC1.3 23.14,30.86 R6.1 25,30.5 27,32.5 IC5.2
RX_LED
  Top 0.254: IC4.48 77.75,40.25 76.13,41.87 76.13,43.87 75,45 LED2.A
RXD  (via drill 0.3)
  Top 0.254: IC4.38 82.75,40.85 84.1,42.2 v84.1,44.9 | IC6.4 32.05,35.05 32.5,35.5 32.5,38.75 33.25,39.5 52.75,39.5 53.25,39 56.61,39 v56.8,39.2
  Bottom 0.254: v84.1,44.9 84.1,45.4 83.5,46 73.75,46 72.25,44.5 62,44.5 56.8,39.3 v56.8,39.2
SCK  (via drill 0.3)
  Top 0.254: IC4.20 81.25,32.33 85.08,28.5 v90.75,28.5
  Bottom 0.254: JP1.2 29,8.54 29,10.1 30.4,11.5 37,11.5 42,16.5 63.5,16.5 69,22 86.75,22 90.75,26 v90.75,28.5 94.5,28.5 U1.SCK
SLAVE_SNIFF
  Top 0.254: TP1.TP 18,45.5 20.5,43 20.5,36 20.86,35.63 IC3.4 24.14,35.63 R5.1 24.5,35.5 25,35 26.25,35 27.25,36 IC6.2
SS
  Top 0.254: IC7.4 53.5,7.2 54.25,6.45 C1.1
SW
  Top 0.254: IC7.1 51.38,8.03 | 51.38,8.03 51.35,8 | 52,7.72 51.5,7.72 | 51.5,7.72 51.38,7.72 | 52,8.3 51.38,8.3 | 51.5,7.72 51.38,7.85 51.38,8.03
  pour Top (no thermals): 52,7.75 52,8.3 48.2,8.3 47.7,8.85 42.6,8.85 42.6,7.2 47.7,7.2 48.2,7.7
SWDCLK  (via drill 0.3)
  Top 0.254: IC4.45 79.25,40.75 78.5,41.5 v78.5,43 | JP2.4 69.54,15.04 v69.5,15 67.75,15 66.5,16.25 66.5,25 v67,25.5
  Bottom 0.254: v69.5,15 70,14.5 74.34,14.5 J3.4 | v78.5,43 78.5,39.5 78,39 78,31.5 75.5,29 69.25,29 67,26.75 v67,25.5
SWDIO  (via drill 0.3)
  Top 0.254: IC4.46 78.75,40.67 77.75,41.67 v77.75,42.5 | J3.2 73.66,11 71,11 70,12 70,13.77 | v66,25.5 66,16 68.23,13.77 70,13.77 | 70,13.77 JP2.2
  Bottom 0.254: v77.75,42.5 77.75,39.5 77.5,39.25 77.5,32 75,29.5 69,29.5 66,26.5 v66,25.5
TX_LED
  Top 0.254: IC4.39 82.25,41 83.4,42.15 83.4,45.85 82.75,46.5 75.55,46.5 LED3.A
USB/D_N
  Top 0.254: IC4.33 84.35,37.75 84.4,37.8 86.87,37.8 arc45 87.58,38.09 92.19,42.7 arc-45 92.9,43 94.8,43 arc-45 J1.D-
USB/D_P
  Top 0.254: IC4.34 84.35,38.25 84.4,38.2 86.7,38.2 arc45 87.41,38.5 92.02,43.11 arc-45 92.73,43.4 94.92,43.4 arc45 J1.D+
VDDANA
  Top 0.254: IC4.6 76.36,36.75 76.25,36.64 75.75,36.64 75.64,36.75 C15.1
  Top 0.4: C15.1 75.25,36.25 75,36 72.25,36 C14.1 71.62,35.62 L2.2
VDDCORE
  Top 0.254: C20.1 80.25,41.5 IC4.43
XIN32
  Top 0.254: X1.P$2 75.3,41.55 75,41.25 74.75,41.25 74.5,41 C22.1 74.5,40.05 74.83,39.72 75.5,39.72 75.97,39.25 IC4.1
XOUT32
  Top 0.254: X1.P$1 72.2,41.55 72.5,41.25 73,41.25 73.25,41 C23.1 73.25,40.45 74.39,39.31 75.34,39.31 75.9,38.75 IC4.2

### Text on the board
tPlace: SNIFF | TX | RX | GND | Dallas | 3V3 | GND | Card / LED | GND | Reject | 1 | Card | Status | ISP | 3V3 | 3V3 | GND | 3V3 PowerPOD | D6/RFID_RST | 5V0 | GND | SDA | A0/RFID_IRQ | SCL | MISO | MOSI | LCD Interface | Vin | 5V0 | 3V3 | GND | SCK | v0.1 | RFID Interface | D7/RFID_SS | HSNOTTS nh-vend
bPlace: 3V3 | D6/RFID_RST | GND | A0/RFID_IRQ | MISO | MOSI | SCK | RFID Interface | D7/RFID_SS